# Altium schematic sheet 01-PCIe.SchDoc
size Tabloid; Customer: 01910; SheetNumber: 1; SheetTotal: 20
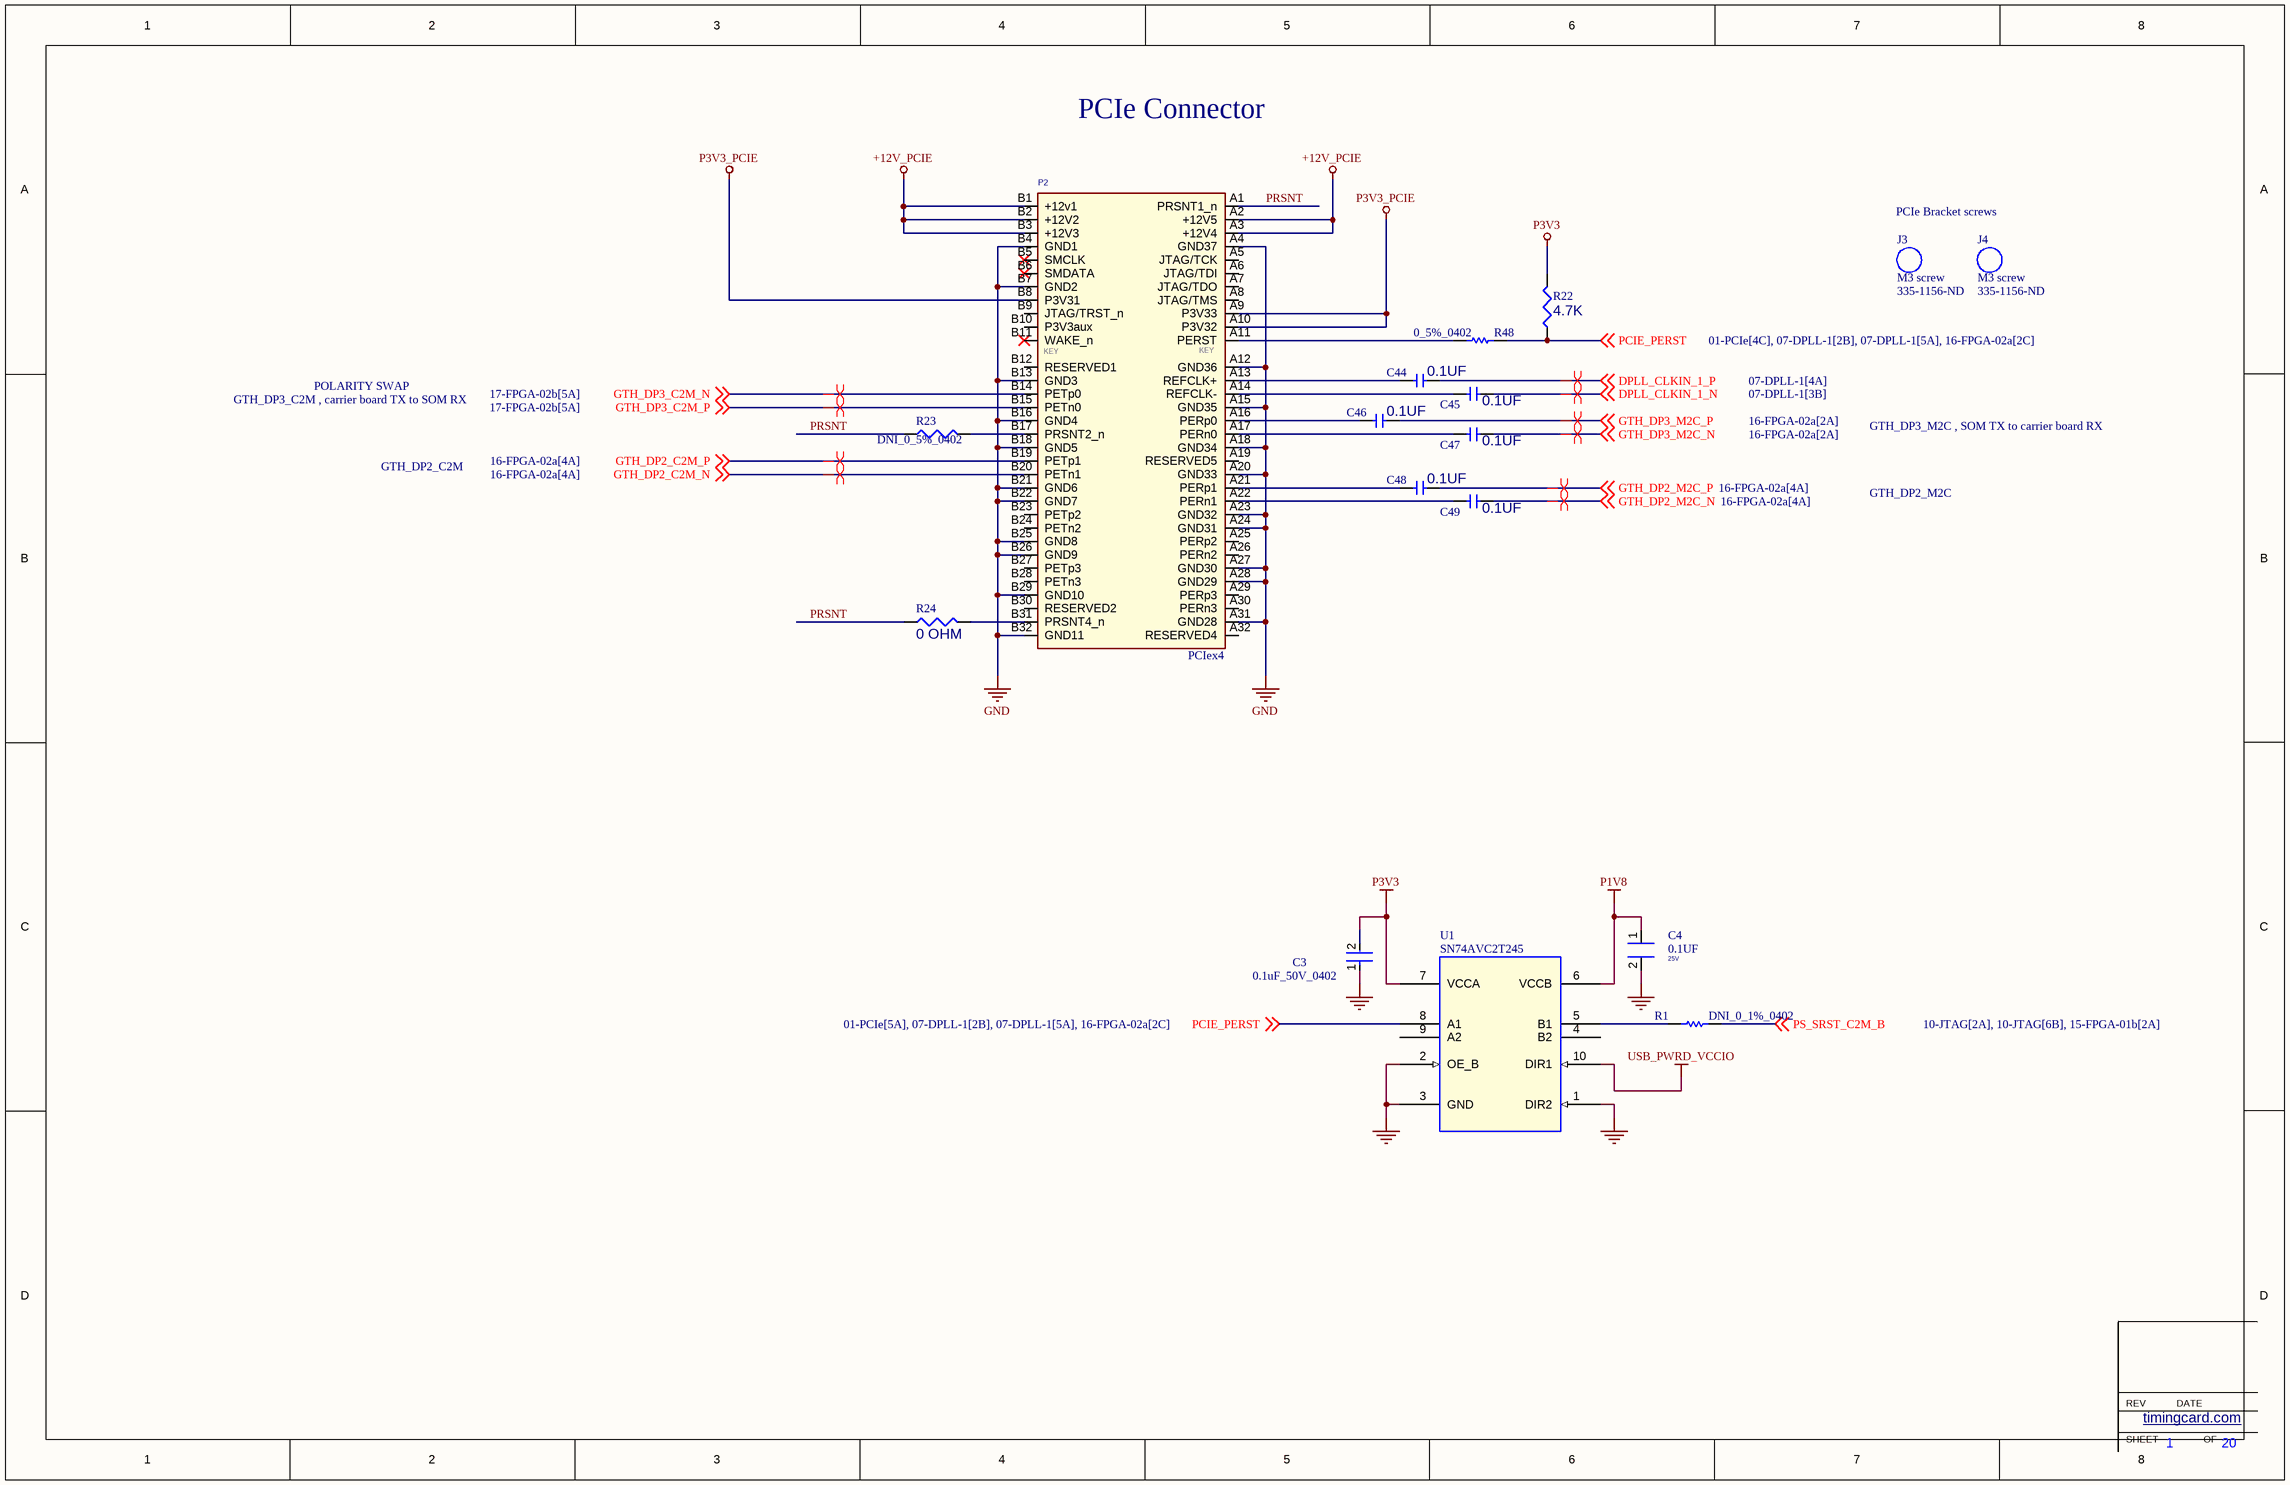
[diagram p0: 01-PCIe.SchDoc]

## Parts
C3  0.1uF_50V_0402  [FP-C1005-050-0_05-IPC_C]
C4  0.1UF  Voltage: 25V  [CAPC100X50X55]
C44  value 0.1UF  [CAPC1005X06N]  (hidden comment: CAP_0402_0.1UF_50V)
C45  value 0.1UF  [CAPC1005X06N]  (hidden comment: CAP_0402_0.1UF_50V)
C46  value 0.1UF  [CAPC1005X06N]  (hidden comment: CAP_0402_0.1UF_50V)
C47  value 0.1UF  [CAPC1005X06N]  (hidden comment: CAP_0402_0.1UF_50V)
C48  value 0.1UF  [CAPC1005X06N]  (hidden comment: CAP_0402_0.1UF_50V)
C49  value 0.1UF  [CAPC1005X06N]  (hidden comment: CAP_0402_0.1UF_50V)
J3  M3 screw  Supplier Part Number 1: 335-1156-ND
J4  M3 screw  Supplier Part Number 1: 335-1156-ND
P2  PCIex4  [PCIE_4LANE_EDGE]
R1  DNI_0_1%_0402  [RESC1005X40X25LL05T05]  (no BOM)
R22  value 4.7K  [RESC1608X50N]  (hidden comment: ERJ-3EKF4701V)
R23  DNI_0_5%_0402  [RESC1005X04N]  (no BOM)
R24  value 0 OHM  [RESC1005X04N]  (hidden comment: ERJ-2GE0R00X)
R48  0_5%_0402  [RESC1005X40X25LL10T10]
U1  SN74AVC2T245  [QFN40P140X180X55-10]

## Nets
+12V_PCIE: P2.A2(+12V5) P2.A3(+12V4) P2.B1(+12v1) P2.B2(+12V2) P2.B3(+12V3)
GND: C3.1 C4.2 P2.A4(GND37) P2.A12(GND36) P2.A15(GND35) P2.A18(GND34) P2.A20(GND33) P2.A23(GND32) P2.A24(GND31) P2.A27(GND30) P2.A28(GND29) P2.A31(GND28) P2.B4(GND1) P2.B7(GND2) P2.B13(GND3) P2.B16(GND4) P2.B18(GND5) P2.B21(GND6) P2.B22(GND7) P2.B25(GND8) P2.B26(GND9) P2.B29(GND10) P2.B32(GND11) U1.1(DIR2) U1.2(OE_B) U1.3(GND)
P1V8: C4.1 U1.6(VCCB)
P3V3: C3.2 R22.2 U1.7(VCCA)
P3V3_PCIE: P2.A9(P3V33) P2.A10(P3V32) P2.B8(P3V31)
USB_PWRD_VCCIO: U1.10(DIR1)
DPLL_CLKIN_1_N: C45.2 ; off-sheet DPLL_CLKIN_1_N
DPLL_CLKIN_1_P: C44.2 ; off-sheet DPLL_CLKIN_1_P
GTH_DP2_C2M_N: P2.B20(PETn1) ; off-sheet GTH_DP2_C2M_N
GTH_DP2_C2M_P: P2.B19(PETp1) ; off-sheet GTH_DP2_C2M_P
GTH_DP2_M2C_N: C49.2 ; off-sheet GTH_DP2_M2C_N
GTH_DP2_M2C_P: C48.2 ; off-sheet GTH_DP2_M2C_P
GTH_DP3_C2M_N: P2.B14(PETp0) ; off-sheet GTH_DP3_C2M_N
GTH_DP3_C2M_P: P2.B15(PETn0) ; off-sheet GTH_DP3_C2M_P
GTH_DP3_M2C_N: C47.2 ; off-sheet GTH_DP3_M2C_N
GTH_DP3_M2C_P: C46.2 ; off-sheet GTH_DP3_M2C_P
PCIE_PERST: R22.1 R48.2 U1.8(A1) ; off-sheet PCIE_PERST
PRSNT: P2.A1(PRSNT1_n) R23.1 R24.1
PS_SRST_C2M_B: R1.2 ; off-sheet PS_SRST_C2M_B
NetC44_1: C44.1 P2.A13(REFCLK+)
NetC45_1: C45.1 P2.A14(REFCLK-)
NetC46_1: C46.1 P2.A16(PERp0)
NetC47_1: C47.1 P2.A17(PERn0)
NetC48_1: C48.1 P2.A21(PERp1)
NetC49_1: C49.1 P2.A22(PERn1)
NetP2_A11: P2.A11(PERST) R48.1
NetP2_B17: P2.B17(PRSNT2_n) R23.2
NetP2_B31: P2.B31(PRSNT4_n) R24.2
NetR1_1: R1.1 U1.5(B1)

Not connected (* = marked no-connect by the designer): P2 A5(JTAG/TCK) A6(JTAG/TDI) A7(JTAG/TDO) A8(JTAG/TMS) A19(RESERVED5) A25(PERp2) A26(PERn2) A29(PERp3) A30(PERn3) A32(RESERVED4) B5(SMCLK)* B6(SMDATA)* B9(JTAG/TRST_n) B10(P3V3aux) B11(WAKE_n)* B12(RESERVED1) B23(PETp2) B24(PETn2) B27(PETp3) B28(PETn3) B30(RESERVED2); U1 4(B2) 9(A2)

## Layout directives
differential pair: DPLL_CLKIN_1_N, DPLL_CLKIN_1_P, GTH_DP2_C2M_N, GTH_DP2_C2M_P, GTH_DP2_M2C_N, GTH_DP2_M2C_P, GTH_DP3_C2M_N, GTH_DP3_C2M_P, GTH_DP3_M2C_N, GTH_DP3_M2C_P

## Notes on the sheet
- PCIe Connector
- PCIe Bracket screws
- GTH_DP3_C2M , carrier board TX to SOM RX
- POLARITY SWAP
- GTH_DP3_M2C , SOM TX to carrier board RX
- GTH_DP2_C2M
- GTH_DP2_M2C
- SHEET
- REV
- timingcard.com <http://timingcard.com>
- DATE
- OF
- (in symbol PCIex4) KEY

## Library data of the parts
C3 = CMP-2000-05393-2: Multilayer Ceramic Capacitors 100nF ±10% 50V X7R SMD 0402; Voltage: 50V; Dielectric Material: Ceramic; Min Operating Temperature: -55°C; Depth: 0.5mm; Radiation Hardening: No; RoHS Compliant: Yes; Voltage Rating (DC): 50V; Lead Free: Lead Free; Resistor Type: Ceramic; Height: 0.5mm; Dielectric: X7R; Thickness: 0.022inch; Case/Package: 0402; Case Code (Metric): 1005; Termination: SMD/SMT; Capacitance: 100nF; Packaging: Tape and Reel; Max Operating Temperature: 125°C; Mount: Surface Mount; Package Quantity: 1; Width: 0.02inch; Weight: 2.3E-05oz; Voltage Rating: 50V; Tolerance: 10%; Construction: Flat; Case Code (Imperial): 0402; Length: 1mm; REACH SVHC: No SVHC; Series: C
C4 = CAP_NP: Cap Cer 100nF 10% 25V X5R 0402; Manufacturer PN: TMK105BJ104KV-F; Manufacturer: TAIYO YUDEN; Agile Part Number: CAP-00068-01; barcode: 100040; OWNER: 4001; ALT_SYMBOLS: CAPC100X50X55RND; PCB Footprint: CAPC100X50X55; PartType: CERAMIC; ROHS: Yes; PRICE: 0.01; Part Type: CERAMIC; Dielectric Type: X5R; CIP Link: http://xsjbrdwin1/CIP-E/Component/Index/All?pn=100040; Tolerance: 10%
C44-C49 = CAP_0402_0.1UF_50V: CAP, CER, 0.1UF, 50V, 10%, X7R, AEC-Q200, 0402; MFG PART NUM: CGA2B3X7R1H104K050BB; VALENTIUM PART NUM: <VALENTIUM>; MFG NAME: TDK; MAXTEMP: 125C; MINTEMP: -55C; CATEGORY: CAP, CER; MODIFY DATE: 10/23/2013; SHEETPART: *; P1: 10%; OTHER: AEC-Q200; P2: 50V; P3: X7R; Size: 0402; DESC: CAP, CER, 0.1UF, 50V, 10%, X7R, AEC-Q200, 0402; Supplier 1: Digi-Key; Supplier Part Number 1: 445-6899-1-ND
P2 = PCIex4: PCIE x4 Edge Connector,OrCAD Symbol,NC; Part Number: 451; Manufacturer: NA; NOTE: NC; Vendor P/N: NA; Part Type: SMT
R1 = CMP-2000-07451-1: Chip Resistor, 0 Ohm, 0.1 W, -55 to 155 degC, 0402 (1005 Metric), RoHS, Tape and Reel; Manufacturer: Panasonic; Voltage Rating (DC): 50V; Temperature Coefficient: 600ppm/��C; Max Power Dissipation: 100mW; Resistance: 0mOhm; Tolerance: 5%; Number of Terminations: 2; Mount: SurfaceMount; Height: 0.35mm; Packaging: TapeandReel; Contact Plating: Tin; Manufacturer URL: http://www.panasonic.com/; Composition: ThickFilm; Max Operating Temperature: 155degC; REACH SVHC: NoSVHC; Case/Package: 0402; Package Reference: 402; Depth: 0.5mm; Package Description: 2-Pin Surface Mount Device, Body 1 x 0.5 mm; Datasheet URL: https://industrial.panasonic.com/cdbs/www-data/pdf/RDA0000/AOA0000C301.pdf; RoHSCompliant: True; Case Code (Imperial): 0402; Military Standard: Not; Min Operating Temperature: -55degC; Power Rating: 100mW; Datasheet Version: 03/2015; Length: 1mm; Case Code (Metric): 1005; Termination: SMD/SMT; Mounting Technology: SurfaceMount; Voltage Rating: 50V; Width: 0.02inch; Package Quantity: 1; Lead Free: LeadFree; Radiation Hardening: No
R22 = RES_0603_4.7K: RES, 4.7K, 1%, 1/10W, TF, 0603; VELENTIUM PART NUM: <VELENTIUM>; MFG NAME: PANASONIC; MAXTEMP: 125C; MINTEMP: -55C; OTHER: 100PPM; SUB: GENERIC; ModifyDate: 7/25/2013; MFG PART NUM: ERJ-3EKF4701V; CATEGORY: RES; Date: 7/26/2013; P1: 1%; P3: TF; P2: 1/10W; SIZE: 0603; Supplier 1: Digi-Key; Supplier Part Number 1: P4.70KHCT-ND; SHEETPART: *; DESC: RES, 4.7K, 1%, 1/10W, TF, 0603
R23 = RES_0402_0: RES, 0. OHM, 1%, 1/16W, TF, AEC-Q200, 0402; MFG PART NUM: ERJ-2GE0R00X; VELENTIUM PART NUM: <VELENTIUM>; MFG NAME: PANASONIC; MAXTEMP: 155C; MINTEMP: -55C; OTHER: 100PPM, AEC-Q200; SUB: GENERIC; DESC: RES, 0 OHM, 1%, 1/16W, TF, AEC-Q200, 0402; VALUE: 0 OHM; ModifyDate: 7/25/2013; CATEGORY: RES; Date: 7/26/2013; P1: 1%; P3: TF; P2: 1/16W; SIZE: 0402; SHEETPART: *; Supplier 1: Digi-Key; Supplier Part Number 1: P0.0JCT-ND
R24 = RES_0402_0: RES, 0. OHM, 1%, 1/16W, TF, AEC-Q200, 0402; VELENTIUM PART NUM: <VELENTIUM>; MFG NAME: PANASONIC; MAXTEMP: 155C; MINTEMP: -55C; OTHER: 100PPM, AEC-Q200; SUB: GENERIC; DESC: RES, 0 OHM, 1%, 1/16W, TF, AEC-Q200, 0402; ModifyDate: 7/25/2013; MFG PART NUM: ERJ-2GE0R00X; CATEGORY: RES; Date: 7/26/2013; P1: 1%; P3: TF; P2: 1/16W; SIZE: 0402; SHEETPART: *; Supplier 1: Digi-Key; Supplier Part Number 1: P0.0JCT-ND
R48 = CMP-2002-04569-1: Manufacturer: KOA Speer; Part Number: RK73Z1ETTP
U1 = SN74AVC2T245: IC Lvl Trans 2-Bit Bidir 500Mbps 1.2-3.6V 50mA UQFN-10; Manufacturer PN: SN74AVC2T245RSWR; Manufacturer: TEXAS INSTRUMENTS; Agile Part Number: ICS-00048-01; EDMVersionID: 493023062; Barcode: 500012; PCB Footprint: QFN40P140X180X55-10; Part Type: BUS TRANSCEIVER; CIP Link: http://xsjbrdwin1/CIP-E/Component/Index/All?pn=500012
J3 J4 = M3 screw: Supplier 1: Digi-Key